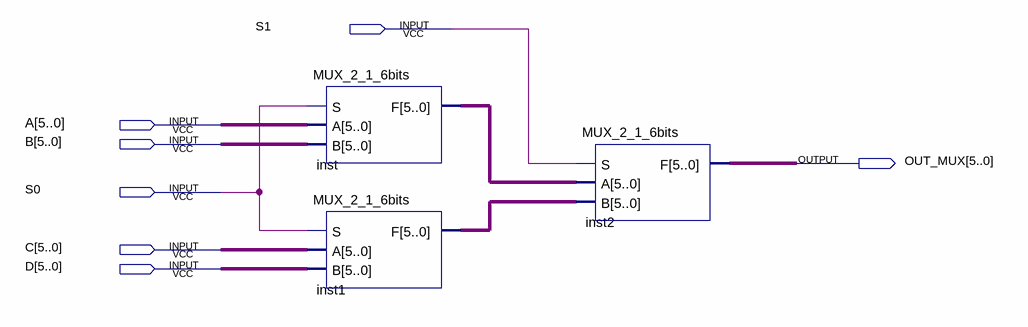
[diagram p0: schematic sheet]
// Quartus schematic MUX_4_1_6bits.bdf as structural Verilog: 3 symbols, 7 pins
module MUX_4_1_6bits (
  input  S1,
  input  [5:0] A,
  input  [5:0] B,
  input  S0,
  input  [5:0] C,
  input  [5:0] D,
  output [5:0] OUT_MUX
);

  wire [5:0] inst1_f, inst_f;

  MUX_2_1_6bits inst (.S(S0), .A(A), .B(B), .F(inst_f));
  MUX_2_1_6bits inst1 (.S(S0), .A(C), .B(D), .F(inst1_f));
  MUX_2_1_6bits inst2 (.S(S1), .A(inst_f), .B(inst1_f), .F(OUT_MUX));
endmodule
